# Altium schematic sheet LTC2949.SchDoc
size A4; SheetNumber: 2; SheetTotal: 3
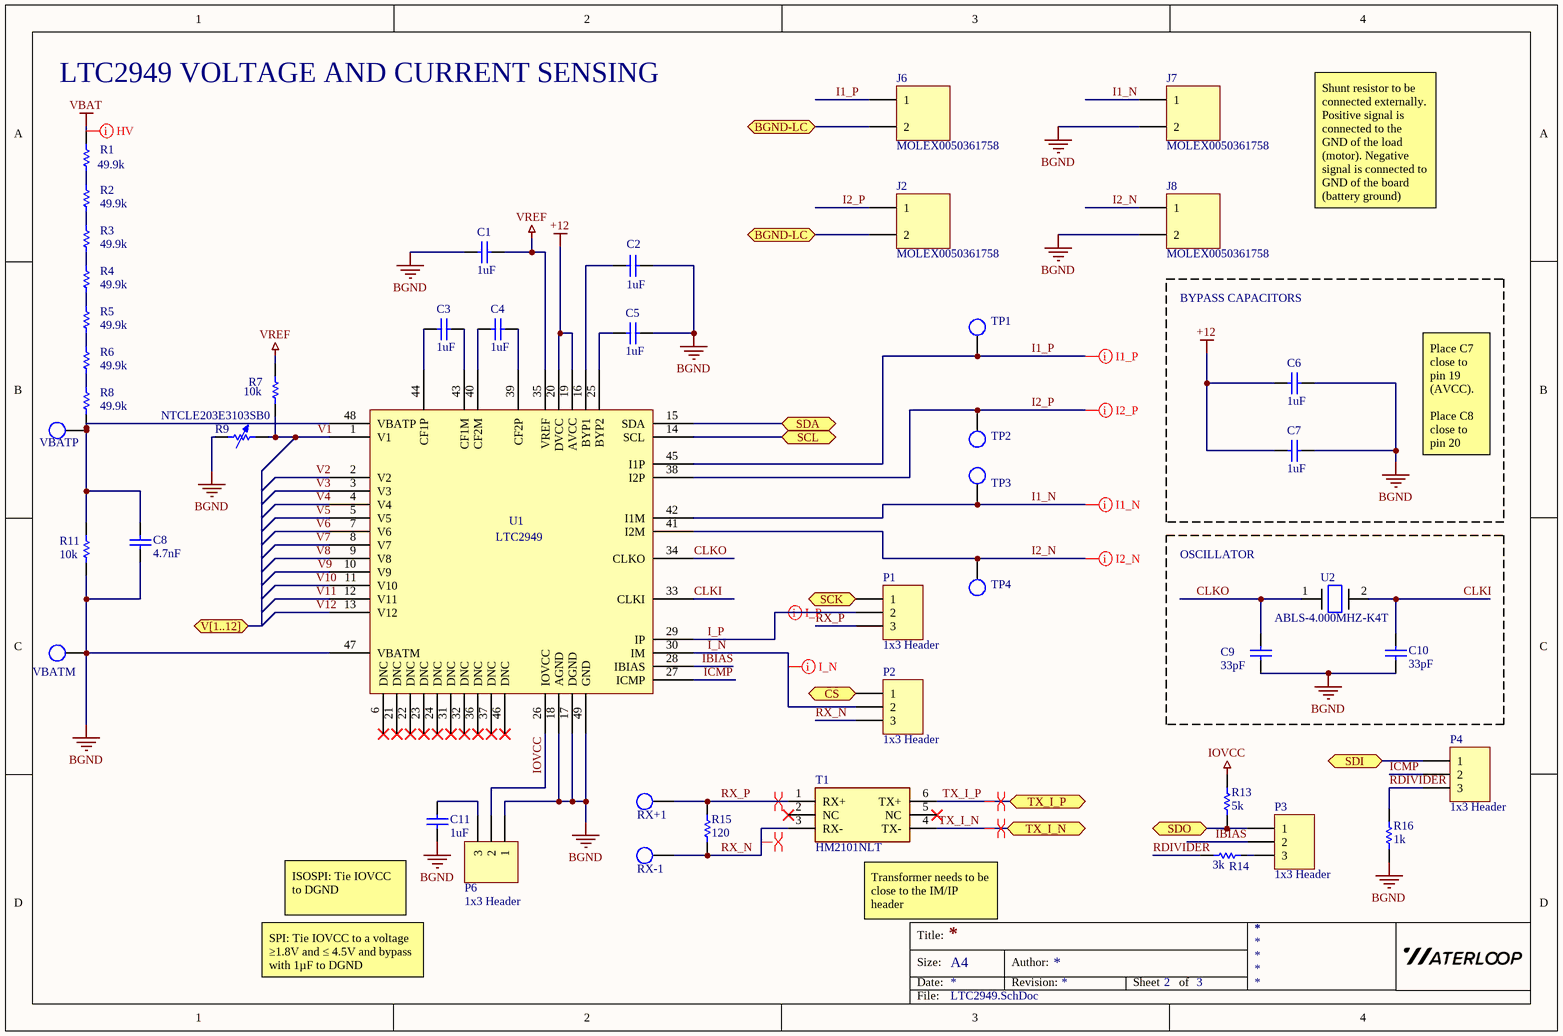
[diagram p0: LTC2949.SchDoc]

## Parts
C1  value 1uF  [0805 - Capacitor]  (hidden comment: Capacitor - Nonpolarized)
C2  value 1uF  [0805 - Capacitor]  (hidden comment: Nonpolarized Capacitor)
C3  value 1uF  [0805 - Capacitor]  (hidden comment: Nonpolarized Capacitor)
C4  value 1uF  [0805 - Capacitor]  (hidden comment: Nonpolarized Capacitor)
C5  value 1uF  [0805 - Capacitor]  (hidden comment: Nonpolarized Capacitor)
C6  value 1uF  [0805 - Capacitor]  (hidden comment: Nonpolarized Capacitor)
C7  value 1uF  [0805 - Capacitor]  (hidden comment: Nonpolarized Capacitor)
C8  value 4.7nF  [0805 - Capacitor]  (hidden comment: Nonpolarized Capacitor)
C9  value 33pF  [0805 - Capacitor]  (hidden comment: Nonpolarized Capacitor)
C10  value 33pF  [0805 - Capacitor]  (hidden comment: Nonpolarized Capacitor)
C11  value 1uF  [0805 - Capacitor]  (hidden comment: Nonpolarized Capacitor)
J2  MOLEX0050361758  [Molex0050361758]
J6  MOLEX0050361758  [Molex0050361758]
J7  MOLEX0050361758  [Molex0050361758]
J8  MOLEX0050361758  [Molex0050361758]
P1  1x3 Header  [HDR1X3]
P2  1x3 Header  [HDR1X3]
P3  1x3 Header  [HDR1X3]
P4  1x3 Header  [HDR1X3]
P6  1x3 Header  [HDR1X3]
R1  value 49.9k  [1206 - Resistor]  (hidden comment: Resistor)
R2  value 49.9k  [1206 - Resistor]  (hidden comment: Resistor)
R3  value 49.9k  [1206 - Resistor]  (hidden comment: Resistor)
R4  value 49.9k  [1206 - Resistor]  (hidden comment: Resistor)
R5  value 49.9k  [1206 - Resistor]  (hidden comment: Resistor)
R6  value 49.9k  [1206 - Resistor]  (hidden comment: Resistor)
R7  value 10k  [0603 - Resistor]  (hidden comment: Resistor)
R8  value 49.9k  [1206 - Resistor]  (hidden comment: Resistor)
R9  Resistor - Variable  [0603 - Resistor]  (value not drawn)
R11  value 10k  [0603 - Resistor]  (hidden comment: Resistor)
R13  value 5k  [0603 - Resistor]  (hidden comment: Resistor)
R14  value 3k  [0603 - Resistor]  (hidden comment: Resistor)
R15  value 120  [0603 - Resistor]  (hidden comment: Resistor)
R16  value 1k  [0603 - Resistor]  (hidden comment: Resistor)
RX+1  Test Point  [Test Point - 5002]  (value not drawn)  (no BOM)
RX-1  Test Point  [Test Point - 5002]  (value not drawn)  (no BOM)
T1  HM2101NLT  [HM2101NLT]
TP1  Test Point  [Test Point - 5002]  (value not drawn)  (no BOM)
TP2  Test Point  [Test Point - 5002]  (value not drawn)  (no BOM)
TP3  Test Point  [Test Point - 5002]  (value not drawn)  (no BOM)
TP4  Test Point  [Test Point - 5002]  (value not drawn)  (no BOM)
U1  LTC2949  [LTC2949]
U2  ABLS-4.000MHZ-K4T  [ABLS_4MHZ-K4T]
VBATM  Test Point  [Test Point - 5002]  (value not drawn)  (no BOM)
VBATP  Test Point  [Test Point - 5002]  (value not drawn)  (no BOM)

## Blocks framed on the sheet
BYPASS CAPACITORS: C6 C7
OSCILLATOR: C9 C10 U2

## Ports
BGND-LC (bidir), CS (bidir), SCK (bidir), SCL (bidir), SDA (bidir), SDI (bidir), SDO (bidir), TX_I_N (bidir), TX_I_P (bidir), V[1..12] (bidir)

## Nets
+12: C6.1 C7.1 U1.19(AVCC) U1.20(DVCC)
BGND: C1.1 C2.2 C5.2 C6.2 C7.2 C8.1 C9.1 C10.1 C11.1 J7.2 J8.2 P6.1 R9.1 R11.1 R16.2 U1.17(DGND) U1.18(AGND) U1.47(VBATM) U1.49(GND) VBATM.1
IOVCC: P6.2 R13.2 U1.26(IOVCC)
VBAT: R1.2
VREF: C1.2 R7.2 U1.35(VREF)
BGND-LC: J2.2 J6.2 ; port BGND-LC
CLKI: C10.2 U1.33(CLKI) U2.2
CLKO: C9.2 U1.34(CLKO) U2.1
CS: P2.1 ; port CS
I1_N: J7.1 TP3.1 U1.42(I1M)
I1_P: J6.1 TP1.1 U1.45(I1P)
I2_N: J8.1 TP4.1 U1.41(I2M)
I2_P: J2.1 TP2.1 U1.38(I2P)
I_N: P2.2 U1.30(IM)
I_P: P1.2 U1.29(IP)
IBIAS: P3.2 U1.28(IBIAS)
ICMP: P4.2 U1.27(ICMP)
RDIVIDER: P4.3 R14.1 R16.1
RX_N: P2.3 R15.1 RX-1.1 T1.3(RX-)
RX_P: P1.3 R15.2 RX+1.1 T1.1(RX+)
SCK: P1.1 ; port SCK
SCL: U1.14(SCL) ; port SCL
SDA: U1.15(SDA) ; port SDA
SDI: P4.1 ; port SDI
SDO: P3.1 R13.1 ; port SDO
TX_I_N: T1.4(TX-) ; port TX_I_N
TX_I_P: T1.6(TX+) ; port TX_I_P
V1: R7.1 R9.2 U1.1(V1)
V2: U1.2(V2)
V3: U1.3(V3)
V4: U1.4(V4)
V5: U1.5(V5)
V6: U1.7(V6)
V7: U1.8(V7)
V8: U1.9(V8)
V9: U1.10(V9)
V10: U1.11(V10)
V11: U1.12(V11)
V12: U1.13(V12)
NetC2_1: C2.1 U1.16(BYP1)
NetC3_1: C3.1 U1.44(CF1P)
NetC3_2: C3.2 U1.43(CF1M)
NetC4_1: C4.1 U1.40(CF2M)
NetC4_2: C4.2 U1.39(CF2P)
NetC5_1: C5.1 U1.25(BYP2)
NetC8_2: C8.2 R8.1 R11.2 U1.48(VBATP) VBATP.1
NetC11_2: C11.2 P6.3
NetP3_3: P3.3 R14.2
NetR1_1: R1.1 R2.2
NetR2_1: R2.1 R3.2
NetR3_1: R3.1 R4.2
NetR4_1: R4.1 R5.2
NetR5_1: R5.1 R6.2
NetR6_1: R6.1 R8.2

Not connected (* = marked no-connect by the designer): T1 2(NC)* 5(NC)*; U1 6(DNC)* 21(DNC)* 22(DNC)* 23(DNC)* 24(DNC)* 31(DNC)* 32(DNC)* 36(DNC)* 37(DNC)* 46(DNC)*

## Layout directives
differential pair: I1_N, I1_P, I2_N, I2_P, I_N, I_P, RX_N, RX_P, TX_I_N, TX_I_P
net class HV: VBAT

## Notes on the sheet
- LTC2949 VOLTAGE AND CURRENT SENSING
- Shunt resistor to be connected externally. Positive signal is connected to the GND of the load (motor). Negative signal is connected to GND of the board (battery ground)
- NTCLE203E3103SB0
- Place C7 close to pin 19 (AVCC).
  Place C8 close to pin 20 (DVCC).
- (near C11) ISOSPI: Tie IOVCC to DGND
- (near T1) Transformer needs to be close to the IM/IP header
- SPI: Tie IOVCC to a voltage ≥1.8V and ≤ 4.5V and bypass with 1µF to DGND
- Title:
- Size:
- Date:
- A4
- Author:
- Revision:
- Sheet
- of
- File:

## Library data of the parts
C1 = Capacitor - Nonpolarized: Nonpolarized Capacitor; Supplier Part Number: *; Supplier: *; Manufacturer: *; Rating: *; Manufacturer Part Number: *
C2-C11 = Capacitor - Nonpolarized: Supplier Part Number: *; Supplier: *; Manufacturer: *; Rating: *; Manufacturer Part Number: *
J2 J6-J8 = MOLEX0050361758: Connector Header Through Hole, Right Angle 2 position -; Manufacturer: Molex; Manufacturer Part Number: 0050361758; Supplier: DigiKey; ComponentLink1Description: Datasheet; ComponentLink1URL: https://www.molex.com/pdm_docs/ps/PS-5556-001.pdf; Supplier Part Number: 0050361758-ND
P1-P4 P6 = 1x3 Header: 1x3 Pin Header
R9 = Resistor - Variable: Variable Resistor; Rating: *; Manufacturer: *; Supplier Part Number: *; Manufacturer Part Number: *; Supplier: *
T1 = HM2101NLT: Pulse Transformer 1:1 Surface Mount 150µH, 450µH
U1 = LTC2949: Manufacturer: Analog Devices; Manufacturer Part Number: LTC2949ILXE#3ZZPBF; Supplier: Mouser; Supplier Part Number: 584-2949ILXE3ZZPBF
U2 = ABLS-4.000MHZ-K4T: Crystal Oscillator 4MHz 18pF
R1-R8 R11 R13-R16 = Resistor: Rating: *; Manufacturer Part Number: *; Manufacturer: *; Supplier Part Number: *; Supplier: *